# EasyEDA Pro project ProProject_AD9833.epro, board v1.0
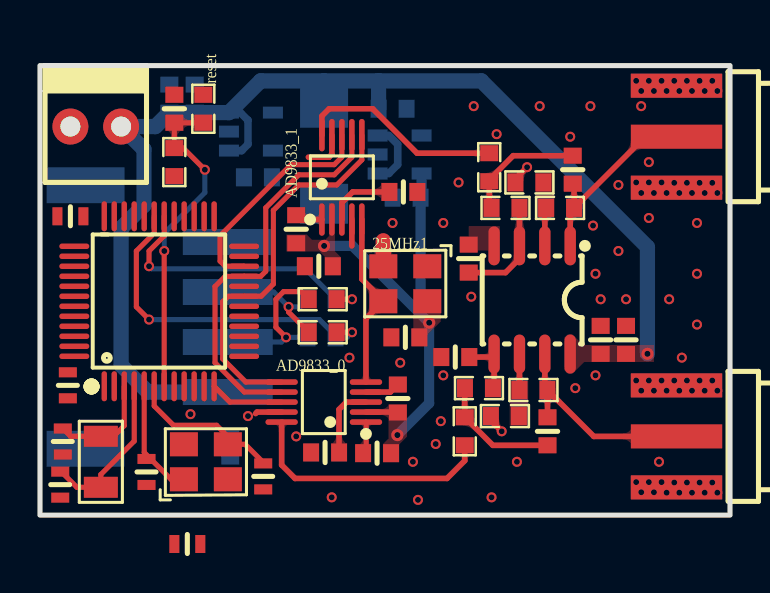
[diagram p8: board, top side]
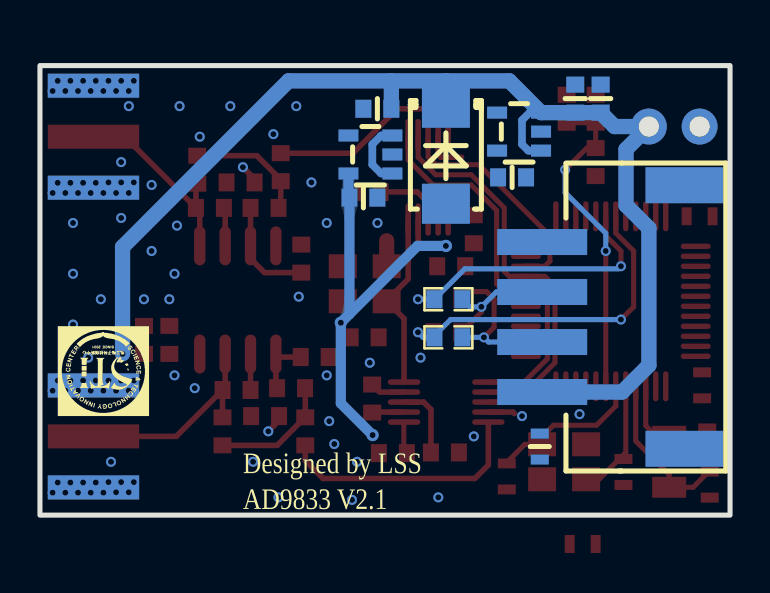
[diagram p9: board, bottom side, seen from below]

Outline 34.54 x 22.48 mm; copper layers: Top Layer, Bottom Layer. Coordinates in mm from the lower left corner of the outline.
Outline path: rectangle 0,22.48 34.54,0
Stack: Top Layer 0.035mm / Dielectric1 1.51mm FR4 er 4.5 / Bottom Layer 0.035mm

## Design rules (mm)
template: JLCPCB Capability(Two Layers Board)
spacing copperThickness1oz (default): track to track 0.102, other pairs 0.152 to 0.3
spacing copperThickness2oz: track to track 0.203, other pairs 0.152 to 0.3
track width copperThickness1oz (default): min 0.127, default 0.254, max 2.54
track width copperThickness2oz: min 0.203, default 0.254, max 2.54
differential pair differentialPair (default): width min 0.127, default 0.254, max 2.54; gap min 0.152, default 0.152
via viaSize (default): diameter min 0.5, default 0.61, max 10; hole min 0.3, default 0.305, max 6.3

## Placement (name value [footprint] x y rotation side)
25MHz1  25MHz  [OSC-SMD_4P-L3.2-W2.5-BL]  18.29 11.57 180 top
AD9833_0  AD9833WBRMZ-REEL  [MSOP-10_L3.0-W3.0-P0.50-LS5.0-BL]  14.21 5.65 90 top
AD9833_1  AD9833WBRMZ-REEL  [MSOP-10_L3.0-W3.0-P0.50-LS5.0-BL]  15.11 16.89 0 top
C1  10nF  [C0603]  16.88 3.1 180 top
C2  10nF  [C0603]  12.83 14.3 90 top
C3  10uF  [C0603]  6.48 20.83 270 bottom
C4  100nF  [C0603]  17.91 5.83 270 top
C5  100nF  [C0603]  13.96 12.45 0 top
C7  100nF  [C0603]  29.34 8.76 270 top
C8  100nF  [C0603]  18.29 8.89 0 top
C9  100nF  [C0603]  14.27 3.13 0 top
C10  100nF  [C0603]  18.19 16.16 180 top
C11  1uF  [C0603]  17.65 20.32 0 bottom
C12  1uF  [C0603]  18.35 15.88 0 bottom
C13  100nF  [C0603]  28.07 8.76 270 top
C14  1.5pF  [C0603]  21.46 12.83 270 top
C15  1.1pF  [C0603]  26.67 17.27 270 top
C16  1.5pF  [C0603]  20.79 7.9 0 top
C17  1.1pF  [C0603]  25.41 4.19 90 top
C18  20pF  [C0603 V1.2]  5.33 2.16 270 top
C19  20pF  [C0603 V1.2]  11.18 1.94 90 top
C20  20pF  [C0603 V1.2]  1.14 3.68 270 top
C21  20pF  [C0603 V1.2]  1.02 1.52 270 top
C29  0.1uF  [c0603]  6.73 20.32 270 top
C30  1uF  [C0603]  7.75 20.83 270 bottom
C31  1uF  [C0603]  10.91 16.89 0 bottom
C32  100nF  [C0603 V1.2]  1.4 6.49 90 top
C33  100nF  [C0603 V1.2]  1.52 14.94 0 top
C34  100nF  [C0603 V1.2]  7.38 -1.44 0 top
C35  100nF  [C0603 V1.2]  9.53 3.43 90 bottom
CN1  X8821WRS-04-9TSN  [CONN-SMD_X8821WRS-04-9TSN]  5.84 9.91 90 bottom
D4  SMBJ5.0A  [SMB_L4.4-W3.6-LS5.3-RD]  14.22 17.97 270 bottom
Power1  -  [KF2510_2P]  2.79 19.43 0 top
R9  10k  [R0603]  24.5 16.64 0 top
R10  10k  [R0603]  26.03 15.36 0 top
R11  10k  [R0603]  23.3 15.36 180 top
R13  10k  [R0603]  22.49 17.4 90 top
R14  10k  [R0603]  23.27 4.95 0 top
R15  10k  [R0603]  24.7 6.26 0 top
R16  10k  [R0603]  21.97 6.35 180 top
R18  10k  [R0603]  21.26 4.19 270 top
R19  10k  [R0603]  6.73 17.65 270 top
R20  10k  [R0603]  14.15 10.8 180 top
R21  10k  [R0603]  14.15 9.14 180 top
R22  10k  [R0603]  14.1 8.89 0 bottom
R23  10k  [R0603]  14.1 10.8 180 bottom
reset  10k  [R0603]  8.18 20.32 270 top
RF1  BWSMA-KE-P001  [SMA-SMD_BWSMA-KE-P001]  31.75 3.94 0 top
RF2  BWSMA-KE-P001  [SMA-SMD_BWSMA-KE-P001]  31.75 18.92 0 top
U6  TPLP5907MFX-3.3  [SOT-23-5_L2.9-W1.6-P0.95-LS2.8-BR]  18 18.03 180 bottom
U7  OPA2350UA/2K5G4  [SOIC-8_L5.0-W4.0-P1.27-LS6.1-BL]  24.64 10.76 180 top
U8  STM32F103C8T6  [LQFP-48_L7.0-W7.0-P0.50-LS9.0-BL]  5.97 10.69 0 top
U9  TPS7A2033PDBVR  [SOT-23-5_L2.9-W1.6-P0.95-LS2.8-BR]  10.56 19.18 180 bottom
X1  8MHz  [OSC-SMD_4P-L3.2-W2.5-BL]  8.31 2.67 0 top
X2  32.768kHz  [OSC-SMD_L3.2-W1.5]  3.05 2.67 270 top

## Footprints (pads in the part's own frame, mm; a bottom-side part is the same pattern mirrored in y, then rotated)
C0603
  rect 0.8x0.9 smd: 1(-0.7,0) 2(0.7,0)
c0603
  rect 0.8x0.9 smd: 1(-0.7,0) 2(0.7,0)
C0603 V1.2
  rect 0.5x0.9 smd: 1(-0.65,0) 2(0.65,0)
CONN-SMD_X8821WRS-04-9TSN
  rect 1.3x4.5 smd: 1(-3.75,3.56) 2(-1.25,3.56) 3(1.25,3.56) 4(3.75,3.56)
  rect 1.8x3.9 smd: 5(6.59,-3.56) 6(-6.59,-3.56)
KF2510_2P
  rrect 1.8x1.8 hole 1: 1(-1.27,0) 2(1.27,0)
LQFP-48_L7.0-W7.0-P0.50-LS9.0-BL
  oval 0.27x1.5 smd: 1(-2.75,-4.25) 2(-2.25,-4.25) 3(-1.75,-4.25) 4(-1.25,-4.25) 5(-0.75,-4.25) 6(-0.25,-4.25) 7(0.25,-4.25) 8(0.75,-4.25) 9(1.25,-4.25) 10(1.75,-4.25) 11(2.25,-4.25) 12(2.75,-4.25) 25(2.75,4.25) 26(2.25,4.25) 27(1.75,4.25) 28(1.25,4.25) 29(0.75,4.25) 30(0.25,4.25) 31(-0.25,4.25) 32(-0.75,4.25) 33(-1.25,4.25) 34(-1.75,4.25) 35(-2.25,4.25) 36(-2.75,4.25)
  oval 1.5x0.27 smd: 13(4.25,-2.75) 14(4.25,-2.25) 15(4.25,-1.75) 16(4.25,-1.25) 17(4.25,-0.75) 18(4.25,-0.25) 19(4.25,0.25) 20(4.25,0.75) 21(4.25,1.25) 22(4.25,1.75) 23(4.25,2.25) 24(4.25,2.75) 37(-4.25,2.75) 38(-4.25,2.25) 39(-4.25,1.75) 40(-4.25,1.25) 41(-4.25,0.75) 42(-4.25,0.25) 43(-4.25,-0.25) 44(-4.25,-0.75) 45(-4.25,-1.25) 46(-4.25,-1.75) 47(-4.25,-2.25) 48(-4.25,-2.75)
MSOP-10_L3.0-W3.0-P0.50-LS5.0-BL
  oval 0.28x1.62 smd: 1(-1,-2.11) 2(-0.5,-2.11) 3(0,-2.11) 4(0.5,-2.11) 5(1,-2.11) 6(1,2.11) 7(0.5,2.11) 8(0,2.11) 9(-0.5,2.11) 10(-1,2.11)
OSC-SMD_4P-L3.2-W2.5-BL
  rect 1.4x1.2 smd: 1(-1.1,-0.875) 2(1.1,-0.875) 3(1.1,0.875) 4(-1.1,0.875)
OSC-SMD_L3.2-W1.5
  rect 1.05x1.7 smd: 1(-1.275,0) 2(1.275,0)
R0603
  rect 0.8x0.9 smd: 1(-0.7,0) 2(0.7,0)
SMA-SMD_BWSMA-KE-P001
  rect 4.572x1.2 smd: 1(0.115,-2.55) 2(0.115,2.55) 5(0.115,0)
  rect 4.572x1.2 smd far side: 3(0.115,2.55) 4(0.115,-2.55)
SMB_L4.4-W3.6-LS5.3-RD
  rect 2x2.4 smd: 1(-2.4,0) 2(2.4,0)
SOIC-8_L5.0-W4.0-P1.27-LS6.1-BL
  oval 0.569x1.95 smd: 1(-1.905,-2.705) 2(-0.635,-2.705) 3(0.635,-2.705) 4(1.905,-2.705) 5(1.905,2.705) 6(0.635,2.705) 7(-0.635,2.705) 8(-1.905,2.705)
SOT-23-5_L2.9-W1.6-P0.95-LS2.8-BR
  rect 1x0.6 smd: 1(1.1,-0.95) 2(1.1,0) 3(1.1,0.95) 4(-1.1,0.95) 5(-1.1,-0.95)

## Nets
3V3: C31.2 C32.2 C33.2 C34.2 C35.2 R19.2 U8.9 U8.24 U8.36 U8.48 U9.5
+5V: C3.2 C7.2 C11.1 C13.2 C30.2 CN1.1 D4.1 Power1.2 U6.1 U6.3 U7.8 U9.1 U9.3
GND: 25MHz1.2 AD9833_0.4 AD9833_0.9 AD9833_1.4 AD9833_1.9 C3.1 C4.1 C5.1 C7.1 C8.1 C9.1 C10.1 C11.2 C12.1 C13.1 C14.1 C16.1 C18.2 C19.1 C20.2 C21.2 C29.1 C30.1 C31.1 C32.1 C33.1 C34.1 C35.1 CN1.4 CN1.5 CN1.6 D4.2 Power1.1 R9.1 R14.1 reset.1 RF1.1 RF1.2 RF1.3 RF1.4 RF2.1 RF2.2 RF2.3 RF2.4 U6.2 U7.4 U8.8 U8.23 U8.35 U8.47 U9.2 X1.2 X1.4
VCC: 25MHz1.4 AD9833_0.2 AD9833_1.2 C1.1 C2.1 C4.2 C5.2 C8.2 C12.2 U6.5
8M_IN: C18.1 U8.5 X1.1
8M_OUT: C19.2 U8.6 X1.3
32K_IN: C20.1 U8.3 X2.1
32K_OUT: C21.1 U8.4 X2.2
A0: U8.10
A1: U8.11
A2: AD9833_0.8 U8.12
A3: U8.13
A4: U8.14
A5: U8.15
A6: U8.16
A7: U8.17
A8: U8.29
A9: R20.1 R23.1 U8.30
A10: R21.1 R22.2 U8.31
A11: U8.32
A12: U8.33
A13: U8.34
A14: U8.37
A15: U8.38
B0: U8.18
B1: AD9833_0.6 AD9833_1.6 U8.19
B3: U8.39
B4: U8.40
B5: U8.41
B6: U8.42
B7: U8.43
B8: U8.45
B9: U8.46
B10: AD9833_0.7 AD9833_1.7 U8.21
B11: AD9833_1.8 U8.22
B12: U8.25
B13: U8.26
B14: U8.27
B15: U8.28
BOOT0: U8.44
BOOT1: U8.20
C13: U8.2
CAP0: AD9833_0.3 C9.2
CAP1: AD9833_1.3 C10.2
COMP0: AD9833_0.1 C1.2
COMP1: AD9833_1.1 C2.2
MCLK: 25MHz1.3 AD9833_0.5 AD9833_1.5
RESET: C29.2 R19.1 reset.2 U8.7
RX: CN1.3 R21.2 R23.2
SIG0: C17.2 R15.2 RF1.5 U7.7
SIG1: C15.2 R10.2 RF2.5 U7.1
TX: CN1.2 R20.2 R22.1
VOUT0: AD9833_0.10 R18.2
VOUT1: AD9833_1.10 R13.2
$1N1456: R9.2 R10.1 U7.2
$1N1462: R14.2 R15.1 U7.6
$1N1470: C14.2 R11.1 U7.3
$1N1471: C15.1 R11.2 R13.1
$1N1472: C16.2 R16.1 U7.5
$1N1475: C17.1 R16.2 R18.1

Pads without a net: 25MHz1 1; U6 4; U8 1; U9 4

## Via types
v1: diameter 0.5, hole 0.299, Top Layer to Bottom Layer, 97 vias
v2: diameter 0.61, hole 0.305, Top Layer to Bottom Layer, 4 vias
v3: diameter 0.5, hole 0.3, Top Layer to Bottom Layer, 8 vias

## Routing (per net, layer and track width the routed paths; a pad name or vN(x,y) marks a point on that pad's centre or on a via; arc(x,y) is an arc through that point)
3V3:
  vias: v3(7.53,5.05)
+5V: length 64.4
  Bottom Layer w0.381: U9.3 10.03,20.13 10.41,19.75 10.41,18.54 10.1,18.23 U9.1 ; U6.1 17.47,17.08 17.91,17.53 17.91,18.54 17.47,18.98 U6.3
  Bottom Layer w0.762: 14.21,21.72 16.96,21.72 ; 14.21,21.72 11.05,21.72 U9.3 C30.2 C3.2 5.78,19.43 Power1.2 5.21,18.29 5.21,15.49 4.06,14.35 4.06,7.49 5.4,6.16 CN1.1 ; 14.21,21.72 14.22,21.7 D4.1 ; 16.96,21.72 22.1,21.72 30.41,13.41 v2(30.41,8.07) ; 16.96,21.72 16.95,21.71 16.95,20.32
GND: length 9.9
  Top Layer w0.28: R14.1 22.57,4.73 v1(23.11,4.19) ; C4.1 17.54,6.15 AD9833_0.4 ; AD9833_1.9 14.61,18.04 14.47,17.9 13.44,17.9 ; 10.8,5.08 10.87,5.15 12.1,5.15 ; AD9833_1.4 15.61,13.46 ; R9.1 23.8,16.82 v1(24.38,17.4)
  Top Layer w0.762: 25MHz1.2 17.19,13.72
  vias: v1(10.41,4.95) v1(12.83,3.94) v1(14.61,0.89) v1(15.49,7.87) v1(17.65,14.61) v1(18.03,7.62) v1(18.67,2.67) v1(18.92,0.76) v1(19.81,3.56) v1(20.07,4.7) v1(20.19,14.61) v1(20.19,6.99) v1(20.96,16.64) v1(21.59,10.92) v1(21.71,20.45) v1(22.61,0.89) v1(22.86,19.05) v1(23.88,2.67) v1(25.02,20.45) v1(26.54,18.92) v1(26.8,6.35) v1(27.56,20.45) v1(27.69,14.48) v1(27.81,12.07) v1(27.81,6.99) v1(28.07,10.8) v1(28.96,16.51) v1(28.96,13.21) v1(29.34,10.8) v1(29.84,21.72) v1(29.84,16.64) v1(29.84,6.73) v1(29.84,1.65) v1(30.1,21.21) v1(30.09,20.45) v1(30.1,16.11) v1(30.1,6.22) v1(30.1,1.14) v1(30.48,21.72) v1(30.48,17.65) v1(30.48,16.64) v1(30.48,14.86) v1(30.48,6.73) v1(30.48,1.65) v1(30.73,21.21) v1(30.73,16.11) v1(30.73,6.22) v1(30.73,1.14) v1(30.99,2.67) v1(31.12,21.72) v1(31.12,16.64) v1(31.12,6.73) v1(31.12,1.65) v1(31.37,21.21) v1(31.37,16.11) v1(31.37,6.22) v1(31.37,1.12) v1(31.5,10.8) v1(31.75,21.72) v1(31.75,16.62) v1(31.75,6.73) v1(31.75,1.63) v1(32,21.21) v1(32,16.11) v1(32,6.22) v1(32,1.12) v1(32.13,7.87) v1(32.39,21.72) v1(32.39,16.62) v1(32.39,6.73) v1(32.39,1.63) v1(32.64,21.21) v1(32.64,16.11) v1(32.64,6.22) v1(32.64,1.12) v1(32.89,14.61) v1(32.89,12.07) v1(32.89,9.53) v1(33.02,21.72) v1(33.02,16.62) v1(33.02,6.73) v1(33.02,1.63) v1(33.27,21.21) v1(33.27,16.11) v1(33.27,6.22) v1(33.27,1.12) v1(33.66,21.72) v1(33.66,16.62) v1(33.66,6.73) v1(33.66,1.63) v1(33.91,21.21) v1(33.91,16.11) v1(33.91,6.22) v1(33.91,1.12)
VCC: length 21.8
  Top Layer w0.28: AD9833_0.2 17.84,5.15 17.9,5.1
  Bottom Layer w0.508: 19.05,10.05 15.64,13.46 v2(14.22,13.46) ; 19.05,10.05 v2(19.48,9.62) 19.48,5.59 v2(17.89,4) ; 19.05,10.05 C12.2 19.1,15.92 U6.5
8M_IN: length 6
  Top Layer w0.254: 5.41,2.94 6.56,1.79 X1.1 ; 5.41,2.94 5.22,3.13 U8.5 ; 5.41,2.94 5.33,2.86
8M_OUT: length 7.8
  Top Layer w0.254: 11.18,2.64 10.27,3.54 X1.3 9.41,3.93 8.84,4.49 6.68,4.49 5.72,5.46 U8.6
32K_IN: length 5.4
  Top Layer w0.254: 1.14,4.33 1.53,3.94 X2.1 3.05,3.94 3.68,3.94 4.22,4.47 U8.3
32K_OUT: length 8.1
  Top Layer w0.254: U8.4 4.72,3.7 3.05,2.03 X2.2 1.85,1.39 1.02,2.22
A2: length 3.7
  Top Layer w0.254: U8.12 9.51,5.65 12.1,5.65
A9: length 14.4
  Top Layer w0.254: R20.1 v3(15.62,10.8) ; v3(5.46,12.45) 5.46,13.21 6.22,13.97 U8.30
  Bottom Layer w0.254: v3(5.46,12.45) 5.59,12.32 13.27,12.32 R23.1 v3(15.62,10.8)
A10: length 17.3
  Top Layer w0.254: U8.31 5.72,14.1 4.83,13.21 4.83,10.41 v3(5.46,9.78) ; R21.1 v3(15.62,9.14)
  Bottom Layer w0.254: v3(15.62,9.14) 15.37,8.89 14.88,8.89 ; 14.88,8.89 R22.2 ; 14.88,8.89 13.99,9.78 v3(5.46,9.78)
B1: length 19.6
  Top Layer w0.254: AD9833_1.6 16.11,17.76 14.86,16.51 12.95,16.51 11.68,15.24 11.68,11.56 11.07,10.94 U8.19 9.42,10.94 9.14,10.67 9.14,7.82 10.31,6.65 12.1,6.65
B10: length 20.2
  Top Layer w0.254: 12.1,6.15 10.23,6.15 8.76,7.62 8.76,11.43 9.27,11.94 10.21,11.94 U8.21 10.22,11.94 11.05,11.94 11.3,12.19 11.3,15.37 12.95,17.02 14.73,17.02 15.61,17.9 AD9833_1.7
B11: length 11.4
  Top Layer w0.254: U8.22 10.22,12.45 9.27,12.45 9.02,12.7 9.02,13.97 12.57,17.53 14.73,17.53 15.11,17.91 AD9833_1.8
CAP0: length 3.7
  Top Layer w0.28: AD9833_0.3 15.34,5.65 14.97,5.28 14.97,3.06
CAP1: length 3.6
  Top Layer w0.28: 17.65,16.16 15.65,16.16 15.11,15.62 AD9833_1.3
COMP0: length 1.6
  Top Layer w0.254: 16.33,3.1 16.33,4.64 AD9833_0.1
COMP1: length 1.4
  Top Layer w0.28: AD9833_1.1 13.04,14.78 C2.2
MCLK: length 8.9
  Top Layer w0.28: AD9833_0.5 16.32,9.83 25MHz1.3 17.19,10.73 16.11,11.81 AD9833_1.5
RESET: length 16.4
  Top Layer w0.254: 6.73,19.49 6.73,18.35 7.17,18.35 v3(8.25,17.27) ; 6.73,19.49 6.86,19.62 reset.2 ; 6.73,19.49 C29.2 ; v1(6.22,13.21) 6.22,13.2 U8.7
  Bottom Layer w0.254: v3(8.25,17.27) 8.25,16.13 6.22,14.1 v1(6.22,13.21)
RX: length 6.1
  Top Layer w0.254: 13.45,9.14 12.45,10.15 v3(12.45,10.41)
  Bottom Layer w0.254: CN1.3 11.7,11.16 v3(12.45,10.41) 13.02,10.41 R23.2
SIG0: length 11.4
  Top Layer w0.28: 25.41,6.25 27.72,3.94 32.63,3.94 ; 25.41,6.25 C17.2 ; 25.41,6.25 25.27,6.39 U7.7
SIG1: length 10.6
  Top Layer w0.28: 26.74,15.36 26.54,15.17 U7.1 ; 26.74,15.36 26.74,16.51 C15.2 ; 26.74,15.36 30.3,18.92 32.63,18.92
TX: length 8.2
  Top Layer w0.254: v3(12.32,8.89) 11.81,9.4 11.81,10.8 12.19,11.18 13.07,11.18 13.45,10.8
  Bottom Layer w0.254: R22.1 v3(12.32,8.89) 12.09,8.66 CN1.2
VOUT0: length 12.7
  Top Layer w0.28: 12.1,4.65 12.1,2.51 12.77,1.83 20.38,1.83 21.26,2.72 R18.2
VOUT1: length 10.4
  Top Layer w0.28: AD9833_1.10 14.11,19.95 14.48,20.32 16.66,20.32 18.88,18.1 R13.2
$1N1456: length 1.9
  Top Layer w0.28: R10.1 25.27,15.3 U7.2
$1N1462: length 1.8
  Top Layer w0.28: U7.6 R15.1
$1N1470: length 5.5
  Top Layer w0.28: 24.13,13.59 24.13,12.95 23.3,12.13 C14.2 ; 24,15.36 U7.3
$1N1471: length 6.1
  Top Layer w0.28: R11.2 22.49,15.47 R13.1 22.49,16.78 23.69,17.97 C15.1
$1N1472: length 3
  Top Layer w0.28: C16.2 22.58,7.9 U7.5 22.73,6.41 R16.1
$1N1475: length 6.2
  Top Layer w0.28: R16.2 21.26,6.34 R18.1 21.27,4.89 22.67,3.49 C17.1

## Copper pours and planes (outline as drawn; the poured copper is in the pictures)
+5V on Top Layer: 26.25,9.03 30.73,9.03 30.73,7.08 26.25,7.08
GND on Top Layer: 21.46,14.45 23.02,14.45 23.02,13.24 21.46,13.24
VCC on Top Layer: 12.34,15.6 15.06,15.6 15.06,11.99 12.34,11.99
VCC on Top Layer: 18.67,11.3 20.07,11.3 20.07,8.48 18.67,8.48
VCC on Top Layer: 17.17,5.53 18.37,5.53 18.37,2.64 17.17,2.64
$1N1456 on Top Layer: 24.82,17.11 25.75,17.11 25.75,14.89 24.82,14.89
$1N1462 on Top Layer: 23.52,6.72 24.44,6.72 24.44,4.48 23.52,4.48

Small or netless copper shapes (teardrops, artwork), in the pictures only: 60 on Top Layer, 6 on Bottom Layer

## Text on the board
Bottom Silkscreen Layer: Designed by LSS / AD9833 V2.1
